# Altium project TMC2300BOB_PCB.PrjPcb
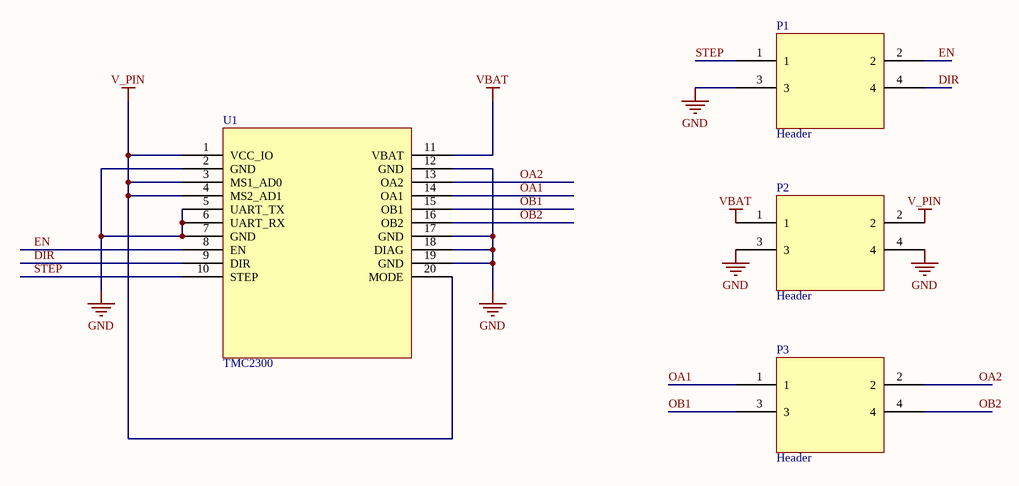
[diagram p0: BOB.SchDoc]
1 sheet, 4 parts. Net scope: global (net labels, ports and power ports of the same name join across sheets).
Board file: BOB.PcbDoc

## Sheet BOB.SchDoc
size A4; SheetNumber: 1; SheetTotal: 1

### Parts
P1  Header  [Connector]
P2  Header  [Connector]
P3  Header  [Connector]
U1  TMC2300  [BOB]

### Nets
GND: P1.3 P2.3 P2.4 U1.2(GND) U1.5(UART_TX) U1.6(UART_RX) U1.7(GND) U1.12(GND) U1.17(GND) U1.18(DIAG) U1.19(GND)
V_PIN: P2.2 U1.1(VCC_IO) U1.3(MS1_AD0) U1.4(MS2_AD1) U1.20(MODE)
VBAT: P2.1 U1.11(VBAT)
DIR: P1.4 U1.9(DIR)
EN: P1.2 U1.8(EN)
OA1: P3.1 U1.14(OA1)
OA2: P3.2 U1.13(OA2)
OB1: P3.3 U1.15(OB1)
OB2: P3.4 U1.16(OB2)
STEP: P1.1 U1.10(STEP)

### Library data of the parts
P1-P3 = Component_2
U1 = Component_1